# Altium project SB PCB - Copy.PrjPcb
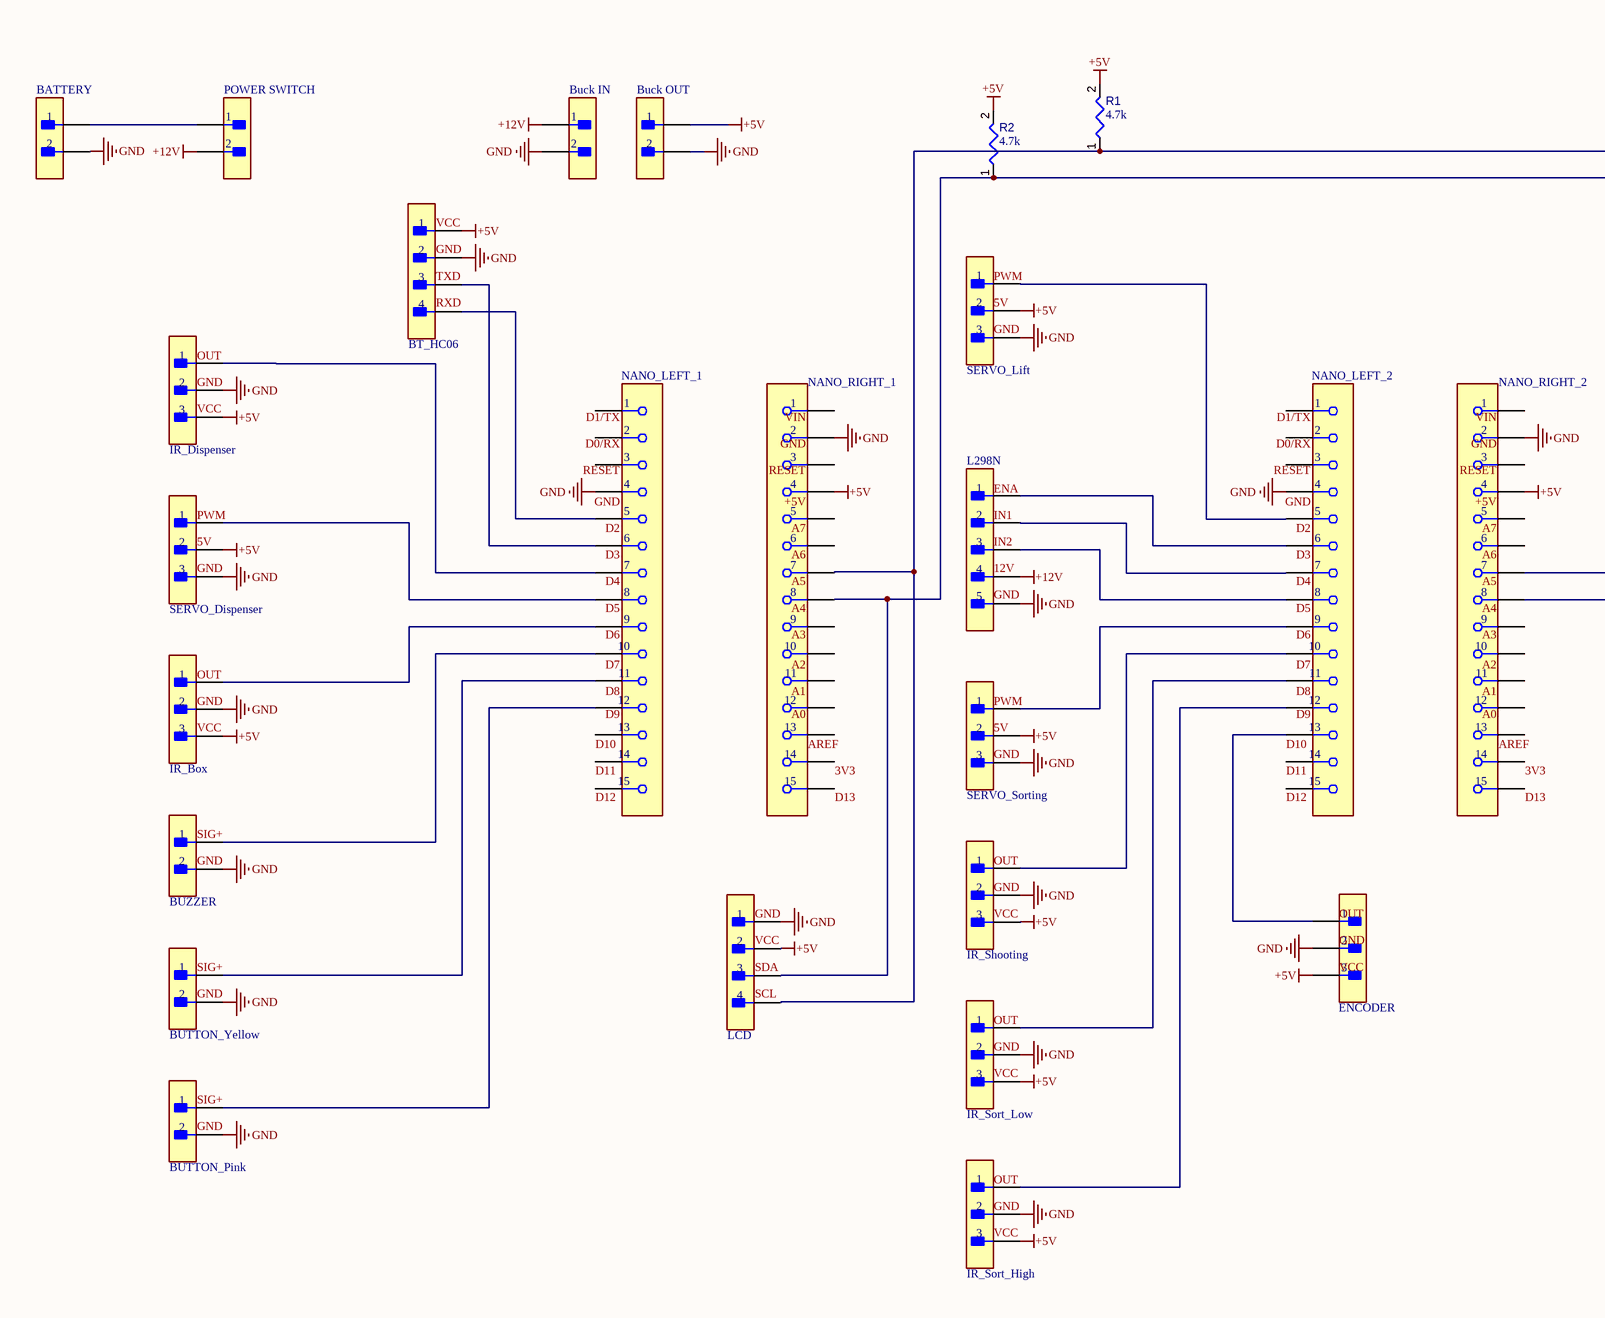
[diagram p0:  Sheet1.SchDoc, left]
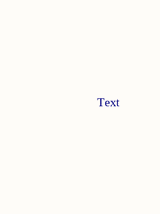
[diagram p1:  Sheet1.SchDoc, right]
1 sheet, 25 parts. Net scope: global (net labels, ports and power ports of the same name join across sheets).
Board file:  PCB1.PcbDoc

## Sheet  Sheet1.SchDoc
size A3; SheetNumber: 1; SheetTotal: 1

### Parts
BATTERY  B2B-EH-A(LF)(SN)  [FP-B2B-EH-A_LF_SN-MFG]  (value not drawn)
BT_HC06  B4B-XH-A(LF)(SN)  [FP-B4B-XH-A_LF_SN-MFG]  (value not drawn)
Buck_IN  B2B-EH-A(LF)(SN)  [FP-B2B-EH-A_LF_SN-MFG]  (value not drawn)
Buck_OUT  B2B-EH-A(LF)(SN)  [FP-B2B-EH-A_LF_SN-MFG]  (value not drawn)
BUTTON_Pink  B2B-EH-A(LF)(SN)  [FP-B2B-EH-A_LF_SN-MFG]  (value not drawn)
BUTTON_Yellow  B2B-EH-A(LF)(SN)  [FP-B2B-EH-A_LF_SN-MFG]  (value not drawn)
BUZZER  B2B-EH-A(LF)(SN)  [FP-B2B-EH-A_LF_SN-MFG]  (value not drawn)
ENCODER  B3B-XH-A(LF)(SN)  [FP-B3B-XH-A_LF_SN-MFG]  (value not drawn)
IR_Box  B3B-XH-A(LF)(SN)  [FP-B3B-XH-A_LF_SN-MFG]  (value not drawn)
IR_Dispenser  B3B-XH-A(LF)(SN)  [FP-B3B-XH-A_LF_SN-MFG]  (value not drawn)
IR_Shooting  B3B-XH-A(LF)(SN)  [FP-B3B-XH-A_LF_SN-MFG]  (value not drawn)
IR_Sort_High  B3B-XH-A(LF)(SN)  [FP-B3B-XH-A_LF_SN-MFG]  (value not drawn)
IR_Sort_Low  B3B-XH-A(LF)(SN)  [FP-B3B-XH-A_LF_SN-MFG]  (value not drawn)
L298N  B5B-XH-AM(LF)(SN)  [FP-B5B-XH-AM_LF_SN-MFG]  (value not drawn)
LCD  B4B-XH-A(LF)(SN)  [FP-B4B-XH-A_LF_SN-MFG]  (value not drawn)
NANO_LEFT_1  SSW-115-01-T-S  [FP-SSW-115-01-T-S-MFG]  (value not drawn)
NANO_LEFT_2  SSW-115-01-T-S  [FP-SSW-115-01-T-S-MFG]  (value not drawn)
NANO_RIGHT_1  SSW-115-01-T-S  [FP-SSW-115-01-T-S-MFG]  (value not drawn)
NANO_RIGHT_2  SSW-115-01-T-S  [FP-SSW-115-01-T-S-MFG]  (value not drawn)
POWER_SWITCH  B2B-EH-A(LF)(SN)  [FP-B2B-EH-A_LF_SN-MFG]  (value not drawn)
R1  value 4.7k  [RESA60-630X240]  (hidden comment: MFR-25FBF52-4K75)
R2  value 4.7k  [RESA60-630X240]  (hidden comment: MFR-25FBF52-4K75)
SERVO_Dispenser  B3B-XH-A(LF)(SN)  [FP-B3B-XH-A_LF_SN-MFG]  (value not drawn)
SERVO_Lift  B3B-XH-A(LF)(SN)  [FP-B3B-XH-A_LF_SN-MFG]  (value not drawn)
SERVO_Sorting  B3B-XH-A(LF)(SN)  [FP-B3B-XH-A_LF_SN-MFG]  (value not drawn)

### Nets
+5V: BT_HC06.1 Buck_OUT.1(OUT+) ENCODER.3(IN2) IR_Box.3(IN2) IR_Dispenser.3(IN2) IR_Shooting.3(IN2) IR_Sort_High.3(IN2) IR_Sort_Low.3(IN2) LCD.2 NANO_RIGHT_1.4 NANO_RIGHT_2.4 R1.2 R2.2 SERVO_Dispenser.2(IN1) SERVO_Lift.2(IN1) SERVO_Sorting.2(IN1)
+12V: Buck_IN.1(IN+) L298N.4 POWER_SWITCH.2(IN-)
GND: BATTERY.2(OUT-) BT_HC06.2 Buck_IN.2(IN-) Buck_OUT.2(OUT-) BUTTON_Pink.2(OUT-) BUTTON_Yellow.2(OUT-) BUZZER.2(OUT-) ENCODER.2(IN1) IR_Box.2(IN1) IR_Dispenser.2(IN1) IR_Shooting.2(IN1) IR_Sort_High.2(IN1) IR_Sort_Low.2(IN1) L298N.5 LCD.1 NANO_LEFT_1.4 NANO_LEFT_2.4 NANO_RIGHT_1.2 NANO_RIGHT_2.2 SERVO_Dispenser.3(IN2) SERVO_Lift.3(IN2) SERVO_Sorting.3(IN2)
NetBATTERY_1: BATTERY.1(OUT+) POWER_SWITCH.1(IN+)
NetBT_HC06_3: BT_HC06.3 NANO_LEFT_1.6
NetBT_HC06_4: BT_HC06.4 NANO_LEFT_1.5
NetBUTTON_Pink_1: BUTTON_Pink.1(OUT+) NANO_LEFT_1.12
NetBUTTON_Yellow_1: BUTTON_Yellow.1(OUT+) NANO_LEFT_1.11
NetBUZZER_1: BUZZER.1(OUT+) NANO_LEFT_1.10
NetENCODER_1: ENCODER.1(EN) NANO_LEFT_2.13
NetIR_Box_1: IR_Box.1(EN) NANO_LEFT_1.9
NetIR_Dispenser_1: IR_Dispenser.1(EN) NANO_LEFT_1.7
NetIR_Shooting_1: IR_Shooting.1(EN) NANO_LEFT_2.10
NetIR_Sort_High_1: IR_Sort_High.1(EN) NANO_LEFT_2.12
NetIR_Sort_Low_1: IR_Sort_Low.1(EN) NANO_LEFT_2.11
NetL298N_1: L298N.1 NANO_LEFT_2.6
NetL298N_2: L298N.2 NANO_LEFT_2.7
NetL298N_3: L298N.3 NANO_LEFT_2.8
NetLCD_3: LCD.3 NANO_RIGHT_1.8 NANO_RIGHT_2.8 R2.1
NetLCD_4: LCD.4 NANO_RIGHT_1.7 NANO_RIGHT_2.7 R1.1
NetNANO_LEFT_1_8: NANO_LEFT_1.8 SERVO_Dispenser.1(EN)
NetNANO_LEFT_2_5: NANO_LEFT_2.5 SERVO_Lift.1(EN)
NetNANO_LEFT_2_9: NANO_LEFT_2.9 SERVO_Sorting.1(EN)

Not connected (* = marked no-connect by the designer): NANO_LEFT_1 1 2 3 13 14 15; NANO_LEFT_2 1 2 3 14 15; NANO_RIGHT_1 1 3 5 6 9 10 11 12 13 14 15; NANO_RIGHT_2 1 3 5 6 9 10 11 12 13 14 15

### Notes on the sheet
- Text
- (near BT_HC06) VCC
- (near BT_HC06) GND
- (near BT_HC06) TXD
- (near BT_HC06) RXD
- (near SERVO_Lift) PWM
- (near SERVO_Lift) 5V
- (near IR_Dispenser) OUT
- (near IR_Dispenser) GND
- (near SERVO_Lift) GND
- (near IR_Dispenser) VCC
- (near NANO_LEFT_1) D1/TX
- (near NANO_LEFT_1) D0/RX
- (near NANO_RIGHT_1) VIN
- (near NANO_RIGHT_1) GND
- (near NANO_LEFT_2) D1/TX
- (near NANO_LEFT_2) D0/RX
- (near NANO_RIGHT_2) VIN
- (near NANO_RIGHT_2) GND
- (near SERVO_Dispenser) PWM
- (near NANO_LEFT_1) RESET
- (near NANO_LEFT_1) D2
- (near NANO_LEFT_1) GND
- (near NANO_RIGHT_1) RESET
- (near NANO_RIGHT_1) A7
- (near NANO_RIGHT_1) +5V
- (near L298N) ENA
- (near L298N) IN1
- (near NANO_LEFT_2) RESET
- (near NANO_LEFT_2) D2
- (near NANO_LEFT_2) GND
- (near NANO_RIGHT_2) RESET
- (near NANO_RIGHT_2) A7
- (near NANO_RIGHT_2) +5V
- (near SERVO_Dispenser) 5V
- (near SERVO_Dispenser) GND
- (near NANO_LEFT_1) D4
- (near NANO_LEFT_1) D3
- (near NANO_RIGHT_1) A5
- (near NANO_RIGHT_1) A6
- (near L298N) IN2
- (near L298N) 12V
- (near NANO_LEFT_2) D4
- (near NANO_LEFT_2) D3
- (near NANO_RIGHT_2) A5
- (near NANO_RIGHT_2) A6
- (near NANO_LEFT_1) D5
- (near NANO_LEFT_1) D6
- (near NANO_LEFT_1) D7
- (near NANO_RIGHT_1) A4
- (near NANO_RIGHT_1) A3
- (near NANO_RIGHT_1) A2
- (near L298N) GND
- (near NANO_LEFT_2) D5
- (near NANO_LEFT_2) D6
- (near NANO_LEFT_2) D7
- (near NANO_RIGHT_2) A4
- (near NANO_RIGHT_2) A3
- (near NANO_RIGHT_2) A2
- (near IR_Box) OUT
- (near IR_Box) GND
- (near NANO_LEFT_1) D8
- (near NANO_LEFT_1) D9
- (near NANO_RIGHT_1) A1
- (near NANO_RIGHT_1) A0
- (near SERVO_Sorting) PWM
- (near NANO_LEFT_2) D8
- (near NANO_LEFT_2) D9
- (near NANO_RIGHT_2) A1
- (near NANO_RIGHT_2) A0
- (near IR_Box) VCC
- (near NANO_LEFT_1) D10
- (near NANO_LEFT_1) D11
- (near NANO_LEFT_1) D12
- (near NANO_RIGHT_1) AREF
- (near NANO_RIGHT_1) 3V3
- (near NANO_RIGHT_1) D13
- (near SERVO_Sorting) 5V
- (near SERVO_Sorting) GND
- (near NANO_LEFT_2) D10
- (near NANO_LEFT_2) D11
- (near NANO_LEFT_2) D12
- (near NANO_RIGHT_2) AREF
- (near NANO_RIGHT_2) 3V3
- (near NANO_RIGHT_2) D13
- (near BUZZER) SIG+
- (near BUZZER) GND
- (near LCD) GND
- (near IR_Shooting) OUT
- (near IR_Shooting) GND
- (near IR_Shooting) VCC
- (near ENCODER) OUT
- (near BUTTON_Yellow) SIG+
- (near LCD) VCC
- (near LCD) SDA
- (near ENCODER) GND
- (near ENCODER) VCC
- (near BUTTON_Yellow) GND
- (near LCD) SCL
- (near IR_Sort_Low) OUT
- (near IR_Sort_Low) GND
- (near BUTTON_Pink) SIG+
- (near BUTTON_Pink) GND
- (near IR_Sort_Low) VCC
- (near IR_Sort_High) OUT
- (near IR_Sort_High) GND
- (near IR_Sort_High) VCC

### Library data of the parts
BATTERY Buck_IN Buck_OUT BUTTON_Pink BUTTON_Yellow BUZZER POWER_SWITCH = CMP-17439-000026-1: CONN HEADER VERT 2POS 2.5MM; Number of Contacts: 2; Current Rating: 3A; Connector Type: Plug; Contact Resistance: 20mR; Gender: Male; Voltage Rating: 250V; Fastening Type: Detent; Depth: 3.8mm; Max Operating Temperature: 85°C; Orientation: Straight; Series: EH; Contact Plating: Tin; Min Operating Temperature: -25°C; Contact Type: Male Pin; Housing Color: White; Termination: Press-Fit; Housing Material: Nylon; Pitch: 2.5mm; Number of Positions: 2; Max Current Rating: 3A; Packaging: Bulk; Lead Free: Lead Free; Number of Rows: 1; Length: 7.5mm; Contact Mating Length: 0.13inch; Color: Natural; Max Voltage Rating (AC): 250V; Contact Material: Copper Alloy; Mount: Through Hole
BT_HC06 LCD = CMP-17439-000250-1: CONN HEADER VERT 4POS 2.5MM; Number of Contacts: 4; Contact Resistance: 20mR; Voltage Rating: 250V; Max Current Rating: 3A; Gender: Male; Wire/Cable Gauge: 22AWG; Mated Stacking Heights: 9.8mm; Insulation Resistance: 1GR; Orientation: Straight; Contact Type: Male Pin; Contact Finish - Mating: TIN; Series: XH; Max Voltage Rating (AC): 250V; Lead Pitch: 2.5mm; Contact Shape: Square; Insulation Color: Natural; Termination: Solder; Lead Free: Lead Free; Voltage Rating (AC): 250V; Number of Rows: 1; Flammability Rating: UL94 V-0; Number of Positions: 4; Max Operating Temperature: 85°C; Package Quantity: 500; Mount: Through Hole; REACH SVHC: No SVHC; Connector Type: Header; Insulation Material: Nylon; Fastening Type: Detent; Min Operating Temperature: -25°C; Housing Color: White; Packaging: Bulk; Contact Plating: Tin; Contact Material: Brass; Max Voltage Rating (DC): 250V; Housing Material: Polyamide; Color: Natural; Material: Polyamide; Pitch: 2.5mm; Depth: 5.75mm; Current Rating: 3A; Length: 12.4mm
ENCODER IR_Box IR_Dispenser IR_Shooting IR_Sort_High IR_Sort_Low SERVO_Dispenser SERVO_Lift SERVO_Sorting = CMP-17439-000014-3: CONN HEADER VERT 3POS 2.5MM; Max Voltage Rating (DC): 250V; Number of Positions: 3; Current Rating: 3A; Gender: Male; Wire/Cable Gauge: 22AWG; Contact Resistance: 20mR; Insulation Resistance: 1GR; Insulation Material: Nylon; Contact Plating: Tin; Depth: 5.75mm; Contact Type: Male Pin; Max Operating Temperature: 85°C; Insulation Color: Natural; Voltage Rating (AC): 250V; Color: Natural; Connector Type: Header; Orientation: Straight; Fastening Type: Detent; Housing Color: White; Min Operating Temperature: -25°C; Termination: Solder; Voltage Rating: 250V; Series: XH; Pitch: 2.5mm; Contact Shape: Square; Number of Rows: 1; Lead Free: Lead Free; Packaging: Bulk; Mount: Through Hole; Flammability Rating: UL94 V-0; Max Voltage Rating (AC): 250V; REACH SVHC: No SVHC; Housing Material: Polyamide; Contact Material: Brass; Lead Pitch: 2.5mm; Contact Finish - Mating: TIN; Length: 9.9mm; Max Current Rating: 3A; Number of Contacts: 3
L298N = CMP-17439-000304-1: CONN HEADER VERT 5POS 2.5MM; Color: Green; Mated Stacking Heights: 9.8mm; Voltage Rating: 250V; Max Current Rating: 3A; Number of Positions: 5; Contact Resistance: 20mR; Depth: 5.75mm; Connector Type: Header; Insulation Material: Nylon; Contact Plating: Copper; Length: 14.9mm; Fastening Type: Detent; Contact Material: Brass; Number of Rows: 1; Contact Type: Male Pin; Housing Material: Polyamide; Housing Color: White; Lead Free: Lead Free; Max Voltage Rating (AC): 250V; Mount: Through Hole; Contact Shape: Square; Min Operating Temperature: -25°C; Packaging: Bulk; Orientation: Straight; Insulation Color: Natural; Series: XH; Flammability Rating: UL94 V-0; Contact Finish - Mating: TIN; Max Operating Temperature: 85°C; Termination: Solder; Pitch: 2.5mm
NANO_LEFT_1 NANO_LEFT_2 NANO_RIGHT_1 NANO_RIGHT_2 = CMP-02766-001723-1: CONN RCPT 15POS 0.1 TIN PCB; Connector Type: Receptacle; Max Voltage Rating (AC): 550V; Mating Cycles: 100; Number of Positions: 15; Pitch: 0.1inch; Max Current Rating: 6.9A; Contact Resistance: 10mR; Contact Type: Female Socket; Color: Black; Depth: 2.41mm; Radiation Hardening: No; Orientation: Straight; Termination: Solder; Series: SSW; Lead Free: Lead Free; Min Operating Temperature: -55°C; Contact Plating: Tin; Contact Material: Bronze; Max Operating Temperature: 105°C; Mount: Through Hole; Packaging: Bulk; Gender: Receptacle; Housing Material: Polymer; RoHS Compliant: Yes; Length: 38.61mm; Number of Rows: 1; REACH SVHC: No SVHC; Width: 2.41mm; Number of Contacts: 15; Housing Color: Black
R1 R2 = CMP-009-00059-4: Axial Resistor, 4.75 KOhm, +/- 1%, 0.25 W, -55 to 155 degC, 2-Pin THD, RoHS, Bulk; Manufacturer: Yageo; Voltage Rating: 250V; Power: 250mW; Datasheet Version: Apr-13; Mounting Technology: TH; Package Reference: MFR-25; RoHS Compliant: True; Composition: MetalFilm; Datasheet URL: http://www.yageo.com/documents/recent/Yageo%20LR_MFR_2013.pdf; Max Operating Temperature: 155°C; Package Quantity: 200; Case/Package: Axial; Package Description: 2-Pin Axial Lead, Dia 2.4 mm, Body Length 6.3 mm; Tolerance: 1%; Packaging: Bulk; Manufacturer URL: http://www.yageo.com/; Min Operating Temperature: -55°C